# EAGLE design Tau-TOP (EAGLE 9.5.2)
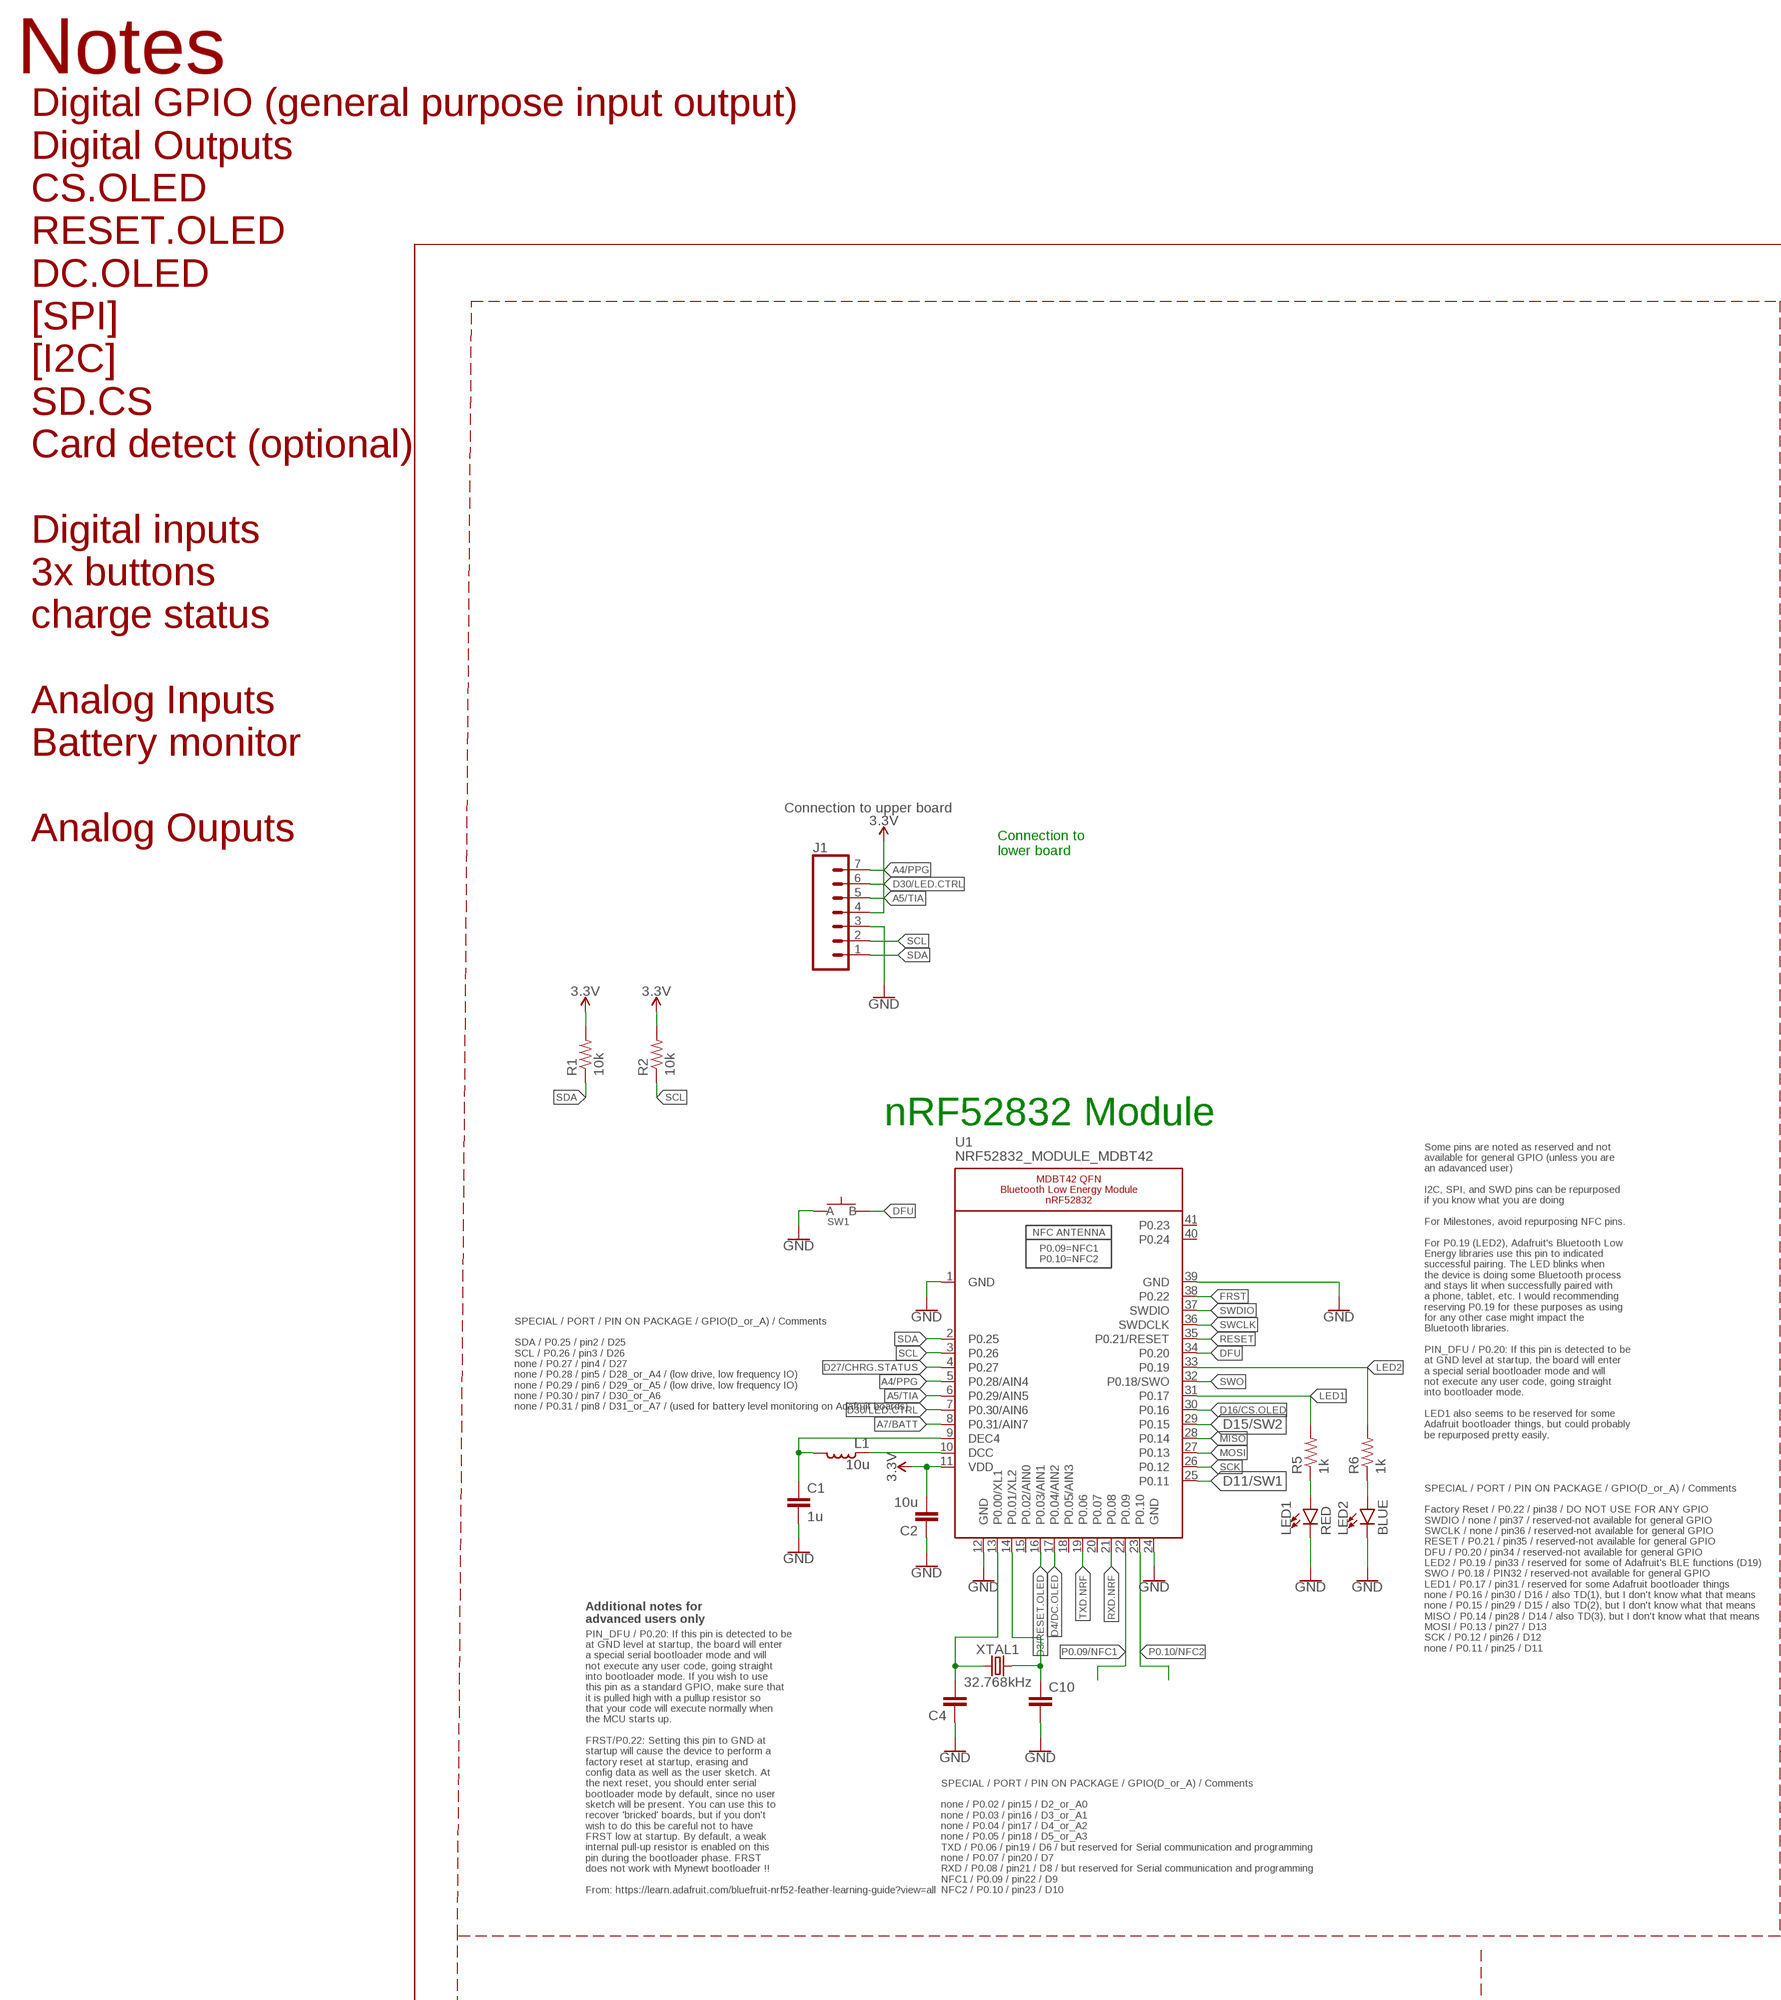
[diagram p0: schematic, sheet 1, part 1 of 3]
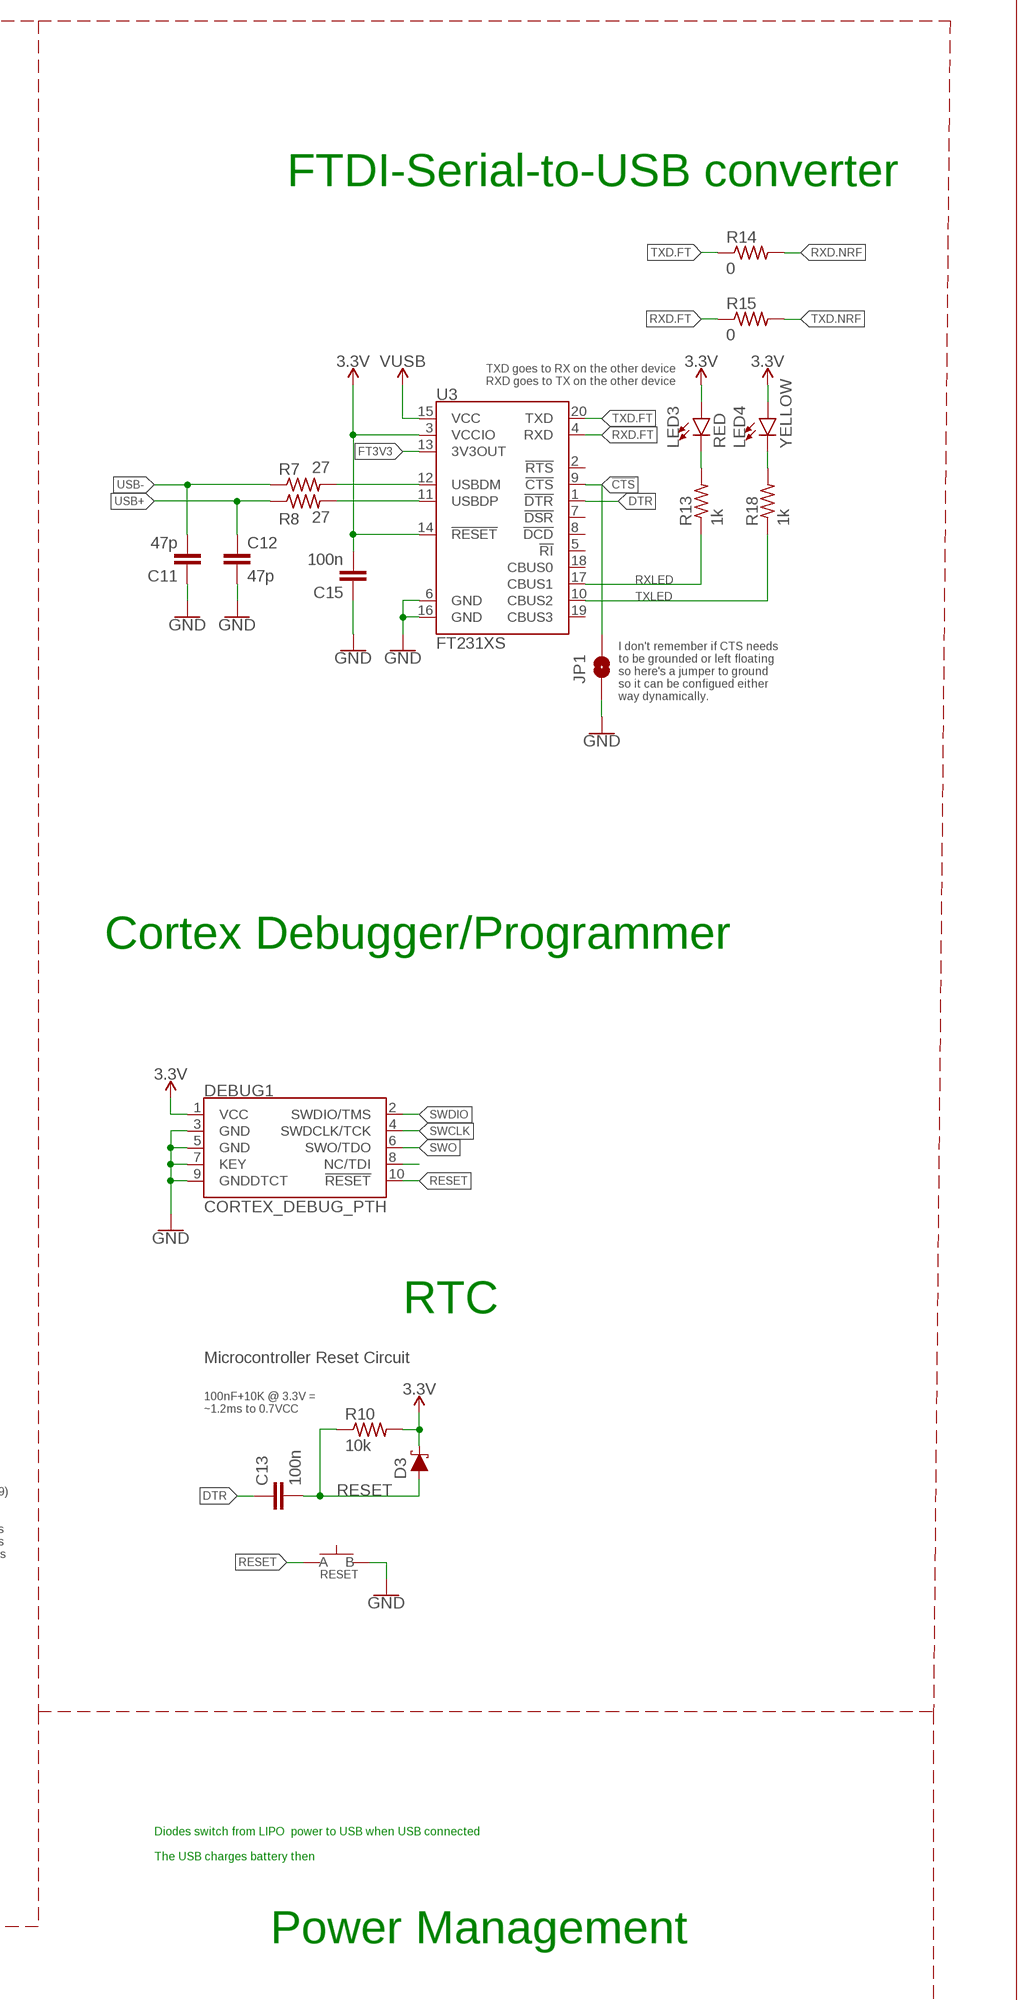
[diagram p1: schematic, sheet 1, part 2 of 3]
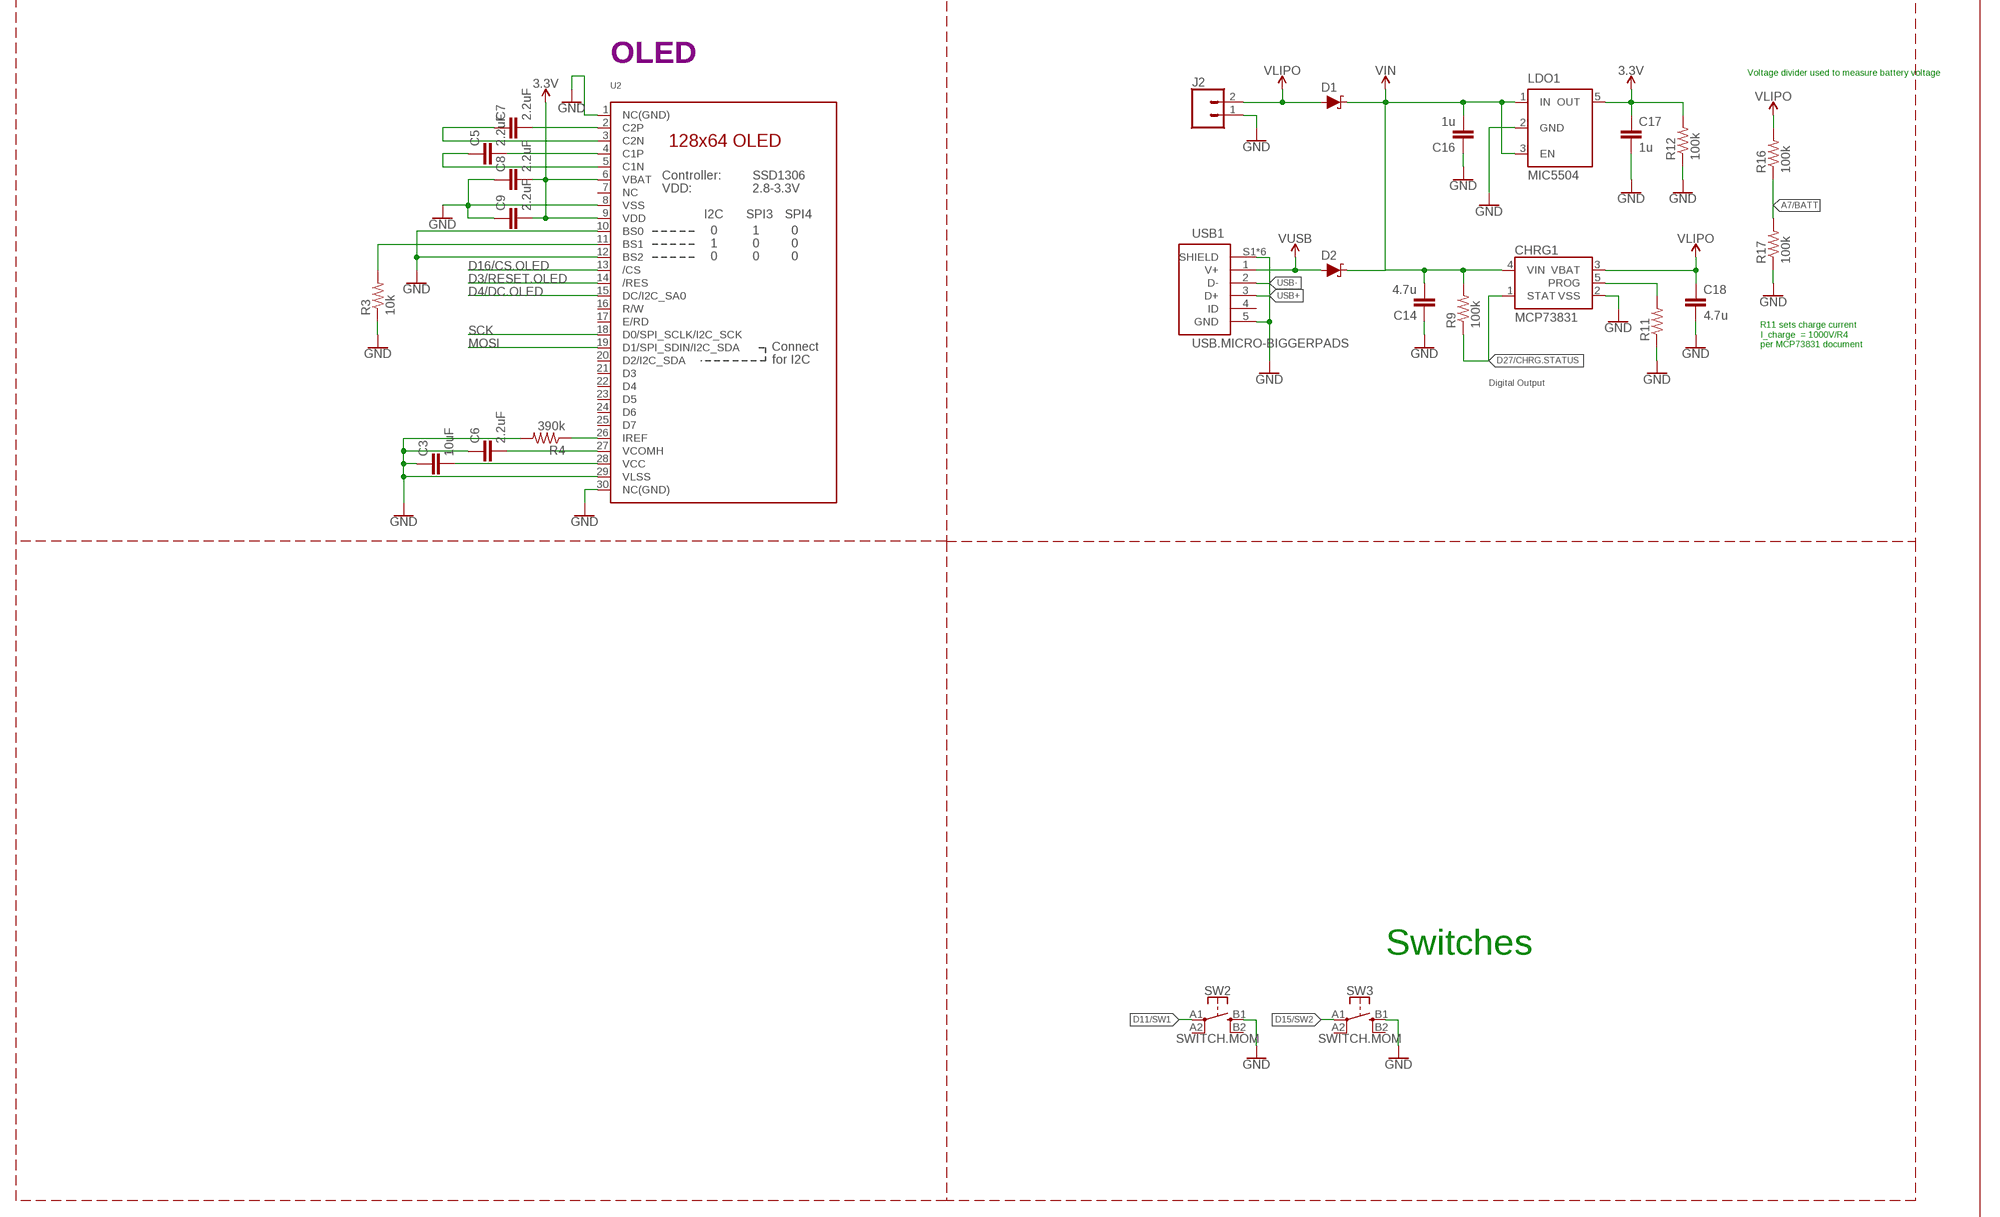
[diagram p2: schematic, sheet 1, part 3 of 3]

## Parts
C1  1u  CAPACITOR0603  [C0603]
C2  10u  CAPACITOR0805  [C0805]
C3  10uF  CAPACITOR0603  [C0603]
C4  CAPACITOR0603  [C0603]
C5  2.2uF  CAPACITOR0402  [C0402]
C6  2.2uF  CAPACITOR0402  [C0402]
C7  2.2uF  CAPACITOR0402  [C0402]
C8  2.2uF  CAPACITOR0402  [C0402]
C9  2.2uF  CAPACITOR0402  [C0402]
C10  CAPACITOR0603  [C0603]
C11  47p  CAPACITOR0603  [C0603]
C12  47p  CAPACITOR0603  [C0603]
C13  100n  CAPACITOR0603  [C0603]
C14  4.7u  CAPACITOR0603  [C0603]
C15  100n  CAPACITOR0603  [C0603]
C16  1u  CAPACITOR0603  [C0603]
C17  1u  CAPACITOR0603  [C0603]
C18  4.7u  CAPACITOR0603  [C0603]
CHRG1  MCP73831  [SOT23-5]
D1  SCHOTTKY-USC  [USC]
D2  SCHOTTKY-USC  [USC]
D3  SCHOTTKY-USC  [USC]
DEBUG1  CORTEX_DEBUG_PTH  [2X5-PTH-1.27MM]
J1  CONN_07-1.27MM  [1X07_1.27MM]
J2  CONN_02  [1X02]
JP1  JUMPER-SMT_2_NO_SILK  [SMT-JUMPER_2_NO_SILK]
L1  10u  INDUCTOR0603  [L0603]
LDO1  MIC5504  [SOT23-5]
LED1  RED  LED0603  [LED-0603]
LED2  BLUE  LED0603  [LED-0603]
LED3  RED  LED0603  [LED-0603]
LED4  YELLOW  LED0603  [LED-0603]
R1  10k  RESISTOR0603  [R0603]
R2  10k  RESISTOR0603  [R0603]
R3  10k  RESISTOR0603  [R0603]
R4  390k  RESISTOR0603  [R0603]
R5  1k  RESISTOR0603  [R0603]
R6  1k  RESISTOR0603  [R0603]
R7  27  RESISTOR0603  [R0603]
R8  27  RESISTOR0603  [R0603]
R9  100k  RESISTOR0603  [R0603]
R10  10k  RESISTOR0603  [R0603]
R11  RESISTOR0603  [R0603]
R12  100k  RESISTOR0603  [R0603]
R13  1k  RESISTOR0603  [R0603]
R14  0  RESISTOR0603  [R0603]
R15  0  RESISTOR0603  [R0603]
R16  100k  RESISTOR0603  [R0603]
R17  100k  RESISTOR0603  [R0603]
R18  1k  RESISTOR0603  [R0603]
RESET  SPST-PTS830GG140-COPY.1-3  [BUTTON-GULLWING]
SW1  SPST-PTS830GG140-COPY.1-3  [BUTTON-GULLWING]
SW2  SWITCH.MOM  [TACTILE_SWITCH_SMD_6.2MM_TALL]
SW3  SWITCH.MOM  [TACTILE_SWITCH_SMD_6.2MM_TALL]
U1  NRF52832_MODULE_MDBT42  [BLE_MODULE_RAYTAC_MDBT42]
U2  DISP_OLED_UG-2864HSWEG01-NO-WRAPAROUND  [UG-2864HSWEG01_0.96IN_NO-WRAPAROUND]
U3  FT231XS  [SSOP20_L]
USB1  USB.MICRO-BIGGERPADS  [USB-MICRO-01.BIGGERPADS]
XTAL1  32.768kHz  CRYSTALECS-.327-12.5-12-C-TR  [2-SMD.NOLEAD.2.0MMTO1.2MM]

## Nets
3.3V: C2.2 C8.2 C9.2 C15.2 C17.1 D3.-(C) DEBUG1.1(VCC) J1.4 LDO1.5(OUT) LED3.A LED4.A R1.2 R2.2 R10.2 R12.2 U1.11(VDD) U2.6(VBAT) U2.9(VDD) U3.3(VCCIO) U3.14(!RESET)
!CTS: JP1.2 U3.9(!CTS)
A4/PPG: J1.7 U1.5(P0.28/AIN4)
A5/TIA: J1.5 U1.6(P0.29/AIN5)
A7/BATT: R16.1 R17.2 U1.8(P0.31/AIN7)
D3/RESET.OLED: U1.16(P0.03/AIN1) U2.14(/RES)
D4/DC.OLED: U1.17(P0.04/AIN2) U2.15(DC/I2C_SA0)
D11/SW1: SW2.A1 U1.25(P0.11)
D15/SW2: SW3.A1 U1.29(P0.15)
D16/CS.OLED: U1.30(P0.16) U2.13(/CS)
D27/CHRG.STATUS: CHRG1.1(STAT) R9.1 U1.4(P0.27)
D30/LED.CTRL: J1.6 U1.7(P0.30/AIN6)
DFU: SW1.3(B) U1.34(P0.20)
DTR: C13.1 U3.1(!DTR)
FRST: U1.38(P0.22)
FT3V3: U3.13(3V3OUT)
GND: C1.2 C2.1 C3.1 C4.1 C6.1 C8.1 C9.1 C10.2 C11.1 C12.2 C14.1 C15.1 C16.1 C17.2 C18.2 CHRG1.2(VSS) DEBUG1.3(GND) DEBUG1.5(GND) DEBUG1.7(KEY) DEBUG1.9(GNDDTCT) J1.3 J2.1 JP1.1 LDO1.2(GND) LED1.C LED2.C R3.1 R4.2 R11.1 R12.1 R17.1 RESET.3(B) SW1.1(A) SW2.B1 SW3.B1 U1.1(GND) U1.12(GND) U1.24(GND) U1.39(GND) U2.1(NC(GND)) U2.8(VSS) U2.10(BS0) U2.12(BS2) U2.29(VLSS) U2.30(NC(GND)) U3.6(GND) U3.16(GND) USB1.5(GND) USB1.S1(SHIELD) USB1.S2(SHIELD) USB1.S3(SHIELD) USB1.S4(SHIELD) USB1.S5(SHIELD) USB1.S6(SHIELD)
LED1: R5.2 U1.31(P0.17)
LED2: R6.2 U1.33(P0.19)
MISO: U1.28(P0.14)
MOSI: U1.27(P0.13) U2.19(D1/SPI_SDIN/I2C_SDA)
N$1: R3.2 U2.11(BS1)
N$2: R4.1 U2.26(IREF)
N$3: C7.2 U2.2(C2P)
N$4: C7.1 U2.3(C2N)
N$5: C5.2 U2.4(C1P)
N$6: C5.1 U2.5(C1N)
N$7: C3.2 U2.28(VCC)
N$8: C6.2 U2.27(VCOMH)
N$9: CHRG1.5(PROG) R11.2
N$22: R7.2 U3.12(USBDM)
N$23: DEBUG1.8(NC/TDI)
N$24: R8.2 U3.11(USBDP)
N$25: LED3.C R13.2
N$26: LED4.C R18.2
N$31: C4.2 U1.13(P0.00/XL1) XTAL1.P$1
N$32: C10.1 U1.14(P0.01/XL2) XTAL1.P$2
N$33: LED1.A R5.1
N$34: LED2.A R6.1
N$35: L1.1 U1.10(DCC)
N$36: C1.1 L1.2 U1.9(DEC4)
P0.09/NFC1: U1.22(P0.09)
P0.10/NFC2: U1.23(P0.10)
RESET: C13.2 D3.+(A) DEBUG1.10(!RESET) R10.1 RESET.1(A) U1.35(P0.21/RESET)
RXD.FT: R15.1 U3.4(RXD)
RXD.NRF: R14.2 U1.21(P0.08)
RXLED: R13.1 U3.17(CBUS1)
SCK: U1.26(P0.12) U2.18(D0/SPI_SCLK/I2C_SCK)
SCL: J1.2 R2.1 U1.3(P0.26)
SDA: J1.1 R1.1 U1.2(P0.25)
SWCLK: DEBUG1.4(SWDCLK/TCK) U1.36(SWDCLK)
SWDIO: DEBUG1.2(SWDIO/TMS) U1.37(SWDIO)
SWO: DEBUG1.6(SWO/TDO) U1.32(P0.18/SWO)
TXD.FT: R14.1 U3.20(TXD)
TXD.NRF: R15.2 U1.19(P0.06)
TXLED: R18.1 U3.10(CBUS2)
USB+: C12.1 R8.1 USB1.3(D+)
USB-: C11.2 R7.1 USB1.2(D-)
V_USB: D2.+(A) U3.15(VCC) USB1.1(V+) ; supply symbol labelled VUSB
VIN: D1.-(C) D2.-(C)
VIN1: C14.2 C16.2 CHRG1.4(VIN) LDO1.1(IN) LDO1.3(EN) R9.2
VLIPO: C18.1 CHRG1.3(VBAT) D1.+(A) J2.2 R16.2
Unconnected: SW2.A2 SW2.B2 SW3.A2 SW3.B2 U1.15(P0.02/AIN0) U1.18(P0.05/AIN3) U1.20(P0.07) U1.40(P0.24) U1.41(P0.23) U2.7(NC) U2.16(R/W) U2.17(E/RD) U2.20(D2/I2C_SDA) U2.21(D3) U2.22(D4) U2.23(D5) U2.24(D6) U2.25(D7) U3.2(!RTS) U3.5(!RI) U3.7(!DSR) U3.8(!DCD) U3.18(CBUS0) U3.19(CBUS3) USB1.4(ID)

## Notes on the sheet
- Notes
- FTDI-Serial-to-USB converter
- TXD goes to RX on the other device
  RXD goes to TX on the other device
- Connection to upper board
- Digital GPIO (general purpose input output)
  Digital Outputs
  CS.OLED
  RESET.OLED
  DC.OLED
  [SPI]
  [I2C]
  SD.CS
  Card detect (optional)
  
  Digital inputs 
  3x buttons
  charge status
  
  Analog Inputs 
  Battery monitor
  
  Analog Ouputs
- Connection to 
  lower board
- I don't remember if CTS needs
  to be grounded or left floating
  so here's a jumper to ground
  so it can be configued either
  way dynamically.
- Cortex Debugger/Programmer
- nRF52832 Module
- SPECIAL / PORT / PIN ON PACKAGE / GPIO(D_or_A) / Comments
  
  SDA / P0.25 / pin2 / D25
  SCL / P0.26 / pin3 / D26
  none / P0.27 / pin4 / D27
  none / P0.28 / pin5 / D28_or_A4 / (low drive, low frequency IO)
  none / P0.29 / pin6 / D29_or_A5 / (low drive, low frequency IO)
  none / P0.30 / pin7 / D30_or_A6
  none / P0.31 / pin8 / D31_or_A7 / (used for battery level monitoring on Adafruit boards)
- RTC
- Some pins are noted as reserved and not
  available for general GPIO (unless you are
  an adavanced user)
  
  I2C, SPI, and SWD pins can be repurposed
  if you know what you are doing
  
  For Milestones, avoid repurposing NFC pins.
  
  For P0.19 (LED2), Adafruit's Bluetooth Low
  Energy libraries use this pin to indicated
  successful pairing. The LED blinks when
  the device is doing some Bluetooth process
  and stays lit when successfully paired with
  a phone, tablet, etc. I would recommending
  reserving P0.19 for these purposes as using
  for any other case might impact the
  Bluetooth libraries.
  
  PIN_DFU / P0.20: If this pin is detected to be
  at GND level at startup, the board will enter
  a special serial bootloader mode and will
  not execute any user code, going straight
  into bootloader mode.
  
  LED1 also seems to be reserved for some
  Adafruit bootloader things, but could probably
  be repurposed pretty easily.
- Microcontroller Reset Circuit
- 100nF+10K @ 3.3V =
  ~1.2ms to 0.7VCC
- Additional notes for
  advanced users only
- SPECIAL / PORT / PIN ON PACKAGE / GPIO(D_or_A) / Comments
  
  Factory Reset / P0.22 / pin38 / DO NOT USE FOR ANY GPIO
  SWDIO / none / pin37 / reserved-not available for general GPIO
  SWCLK / none / pin36 / reserved-not available for general GPIO
  RESET / P0.21 / pin35 / reserved-not available for general GPIO
  DFU / P0.20 / pin34 / reserved-not available for general GPIO
  LED2 / P0.19 / pin33 / reserved for some of Adafruit's BLE functions (D19)
  SWO / P0.18 / PIN32 / reserved-not available for general GPIO
  LED1 / P0.17 / pin31 / reserved for some Adafruit bootloader things
  none / P0.16 / pin30 / D16 / also TD(1), but I don't know what that means
  none / P0.15 / pin29 / D15 / also TD(2), but I don't know what that means
  MISO / P0.14 / pin28 / D14 / also TD(3), but I don't know what that means
  MOSI / P0.13 / pin27 / D13
  SCK / P0.12 / pin26 / D12
  none / P0.11 / pin25 / D11
- Diodes switch from LIPO  power to USB when USB connected
  
  The USB charges battery then
- PIN_DFU / P0.20: If this pin is detected to be
  at GND level at startup, the board will enter
  a special serial bootloader mode and will
  not execute any user code, going straight
  into bootloader mode. If you wish to use
  this pin as a standard GPIO, make sure that
  it is pulled high with a pullup resistor so
  that your code will execute normally when
  the MCU starts up.
  
  FRST/P0.22: Setting this pin to GND at
  startup will cause the device to perform a
  factory reset at startup, erasing and
  config data as well as the user sketch. At
  the next reset, you should enter serial
  bootloader mode by default, since no user
  sketch will be present. You can use this to
  recover 'bricked' boards, but if you don't
  wish to do this be careful not to have
  FRST low at startup. By default, a weak
  internal pull-up resistor is enabled on this
  pin during the bootloader phase. FRST
  does not work with Mynewt bootloader !!
  
  From: https://learn.adafruit.com/bluefruit-nrf52-feather-learning-guide?view=all
- SPECIAL / PORT / PIN ON PACKAGE / GPIO(D_or_A) / Comments
  
  none / P0.02 / pin15 / D2_or_A0
  none / P0.03 / pin16 / D3_or_A1
  none / P0.04 / pin17 / D4_or_A2
  none / P0.05 / pin18 / D5_or_A3
  TXD / P0.06 / pin19 / D6 / but reserved for Serial communication and programming
  none / P0.07 / pin20 / D7
  RXD / P0.08 / pin21 / D8 / but reserved for Serial communication and programming
  NFC1 / P0.09 / pin22 / D9
  NFC2 / P0.10 / pin23 / D10
- Power Management
- OLED
- Voltage divider used to measure battery voltage
- R11 sets charge current
  I_charge  = 1000V/R4
  per MCP73831 document
- Digital Output
- Switches

## Library data of the parts
C1-C18 = LinnesLab-Passives:CAPACITOR
CHRG1 = LinnesLab-Power:MCP73831: MCP73831T Li-Ion, Li-Pol Controller Miniature single cell, fully integrated Li-Ion, Li-polymer charge management controller Datasheet <http://ww1.microchip.com/downloads/en/DeviceDoc/20001984g.pdf> SparkFun Products: SparkFun ESP32 Thing <https://www.sparkfun.com/products/13907> SparkFun 9DoF Razor IMU M0 <https://www.sparkfun.com/products/14001>; PROD_ID: IC-09995
D1-D3 = LinnesLab-DiscreteSemi:SCHOTTKY: Schottky diode A Schottky diode is a semiconductor diode which has a low forward voltage drop and a very fast switching action. Example: Digi-Key Part Number: RB161MM-20CT-ND
DEBUG1 = LinnesLab-Connectors:CORTEX_DEBUG: Cortex Debug Connector - 10 pin Supports JTAG debug, Serial Wire debug, and Serial Wire Viewer. PTH and SMD connector options available. General Connector Information <http://infocenter.arm.com/help/topic/com.arm.doc.faqs/attached/13634/cortex_debug_connectors.pdf> Products: PTH Connector <http://www.digikey.com/product-detail/en/cnc-tech/3220-10-0100-00/1175-1627-ND/3883661> -via Digi-Key SparkFun PSoc <https://www.sparkfun.com/products/13229> SparkFun T <https://www.sparkfun.com/products/13810>
J1 = LinnesLab-Connectors:CONN_07: Multi connection point. Often used as Generic Header-pin footprint for 0.1 inch spaced/style header connections On any of the 0.1 inch spaced packages, you can populate with these: Break Away Headers - Straight <https://www.sparkfun.com/products/116> (PRT-00116) Break Away Male Headers - Right Angle <https://www.sparkfun.com/products/553> (PRT-00553) Female Headers <https://www.sparkfun.com/products/115> (PRT-00115) Break Away Headers - Machine Pin <https://www.sparkfun.com/products/117> (PRT-00117) Break Away Female Headers - Swiss Machine Pin <https://www.sparkfun.com/products/743> (PRT-00743) For SCREWTERMINALS and SPRING TERMINALS visit here: Screw Terimnals on SparkFun.com <https://www.sparkfun.com/search/results?term=Screw+Terminals> (5mm/3.5mm/2.54mm spacing) This device is also useful as a general connection point to wire up your design to another part of your project. Our various solder wires solder well into these plated through hole pads. Hook-Up Wire - Assortment (Stranded, 22 AWG) <https://www.sparkfun.com/products/11375> (PRT-11375) Hook-Up Wire - Assortment (Solid Core, 22 AWG) <https://www.sparkfun.com/products/11367> (PRT-11367) View the entire wire category on our website here <https://www.sparkfun.com/categories/141> Special notes: Molex polarized connector foot print use with SKU : PRT-08231 with associated crimp pins and housings. 1MM SMD Version SKU: PRT-10208 NOTES ON THE VARIANTS LOCK and LOCK_LONGPADS... This footprint was designed to help hold the alignment of a through-hole component (i.e. 6-pin header) while soldering it into place. You may notice that each hole has been shifted either up or down by 0.005 of an inch from it's more standard position (which is a perfectly straight line). This slight alteration caused the pins (the squares in the middle) to touch the edges of the holes. Because they are alternating, it causes a "brace" to hold the component in place. 0.005 has proven to be the perfect amount of "off-center" position when using our standard breakaway headers. Although looks a little odd when you look at the bare footprint, once you have a header in there, the alteration is very hard to notice. Also,if you push a header all the way into place, it is covered up entirely on the bottom side.
J2 = LinnesLab-Connectors:CONN_02: Multi connection point. Often used as Generic Header-pin footprint for 0.1 inch spaced/style header connections On any of the 0.1 inch spaced packages, you can populate with these: Break Away Headers - Straight <https://www.sparkfun.com/products/116> (PRT-00116) Break Away Male Headers - Right Angle <https://www.sparkfun.com/products/553> (PRT-00553) Female Headers <https://www.sparkfun.com/products/115> (PRT-00115) Break Away Headers - Machine Pin <https://www.sparkfun.com/products/117> (PRT-00117) Break Away Female Headers - Swiss Machine Pin <https://www.sparkfun.com/products/743> (PRT-00743) For SCREWTERMINALS and SPRING TERMINALS visit here: Screw Terimnals on SparkFun.com <https://www.sparkfun.com/search/results?term=Screw+Terminals> (5mm/3.5mm/2.54mm spacing) This device is also useful as a general connection point to wire up your design to another part of your project. Our various solder wires solder well into these plated through hole pads. Hook-Up Wire - Assortment (Stranded, 22 AWG) <https://www.sparkfun.com/products/11375> (PRT-11375) Hook-Up Wire - Assortment (Solid Core, 22 AWG) <https://www.sparkfun.com/products/11367> (PRT-11367) View the entire wire category on our website here <https://www.sparkfun.com/categories/141> Special notes: Molex polarized connector foot print use with: PRT-08233 with associated crimp pins and housings. 2.54_SCREWTERM for use with PRT-10571. 3.5mm Screw Terminal footprints for PRT-08084 5mm Screw Terminal footprints for use with PRT-08432
JP1 = LinnesLab-Switches:JUMPER-SMT_2_NO: Normally open jumper This jumper has two pads in close proximity to each other. Apply solder to close the connection. Round pads are easier to solder for beginners, but are a lot larger. SparkFun Product that uses the round pads: SparkFun EL Sequencer <https://www.sparkfun.com/products/12781>
L1 = LinnesLab-Passives:INDUCTOR
LDO1 = LinnesLab-Power:MIC5504: MIC5504 Voltage Regulator Output Voltages: 1.0V to 3.3V Input Voltages: 2.5V to 5.5V Link to Datasheet http://ww1.microchip.com/downloads/en/DeviceDoc/MIC550X.pdf
LED1-LED4 = LinnesLab-LED:LED: LED (Generic) Standard schematic elements and footprints for 5mm, 3mm, 1206, and 0603 sized LEDs. Generic LEDs with no color specified. LTST-C190KGKT: arrow indicates cathode
R1-R18 = LinnesLab-Passives:RESISTOR
RESET SW1 = LinnesLab-Switches:SPST-PTS830GG140-COPY
SW2 SW3 = LinnesLab-Switches:SWITCH.MOM: PTS645SM43SMTR92 LFS
U1 = LinnesLab-Microcontrollers:NRF52832_MODULE_MDBT42: MDBT42 - BLE Module (nRF52832 QFN) VDD: 1.7-3.6V
U2 = LinnesLab-Displays:DISP_OLED_UG-2864HSWEG01: UG-2864HSWEG01 OLED display Both 1.3" and 0.96" models share the same FPC tab footprint, only the screen dimensions vary.
U3 = LinnesLab-DigitalIC:FT231X: FTDI FT231X Full Speed USB to Full-handshake UART This USB2.0 Full Speed IC offers a compact bridge to full handshake UART interfaces. The device is a UART, capable of operating up to 3MBaud, with low power consumption (8mA). The FT231X includes the complete FT-X series feature set and enables USB to be added into a system design quickly and easily over a UART interface. Datasheet <http://cdn.sparkfun.com/datasheets/Components/General%20IC/DS_FT231X.pdf>; DIGIKEY: 768-1156-5-ND; MFN: FT231XS-U
USB1 = LinnesLab-Connectors:USB.MICRO: DigiKey PN: 609-4613-1-ND
XTAL1 = LinnesLab-Clocks:CRYSTAL

## Board
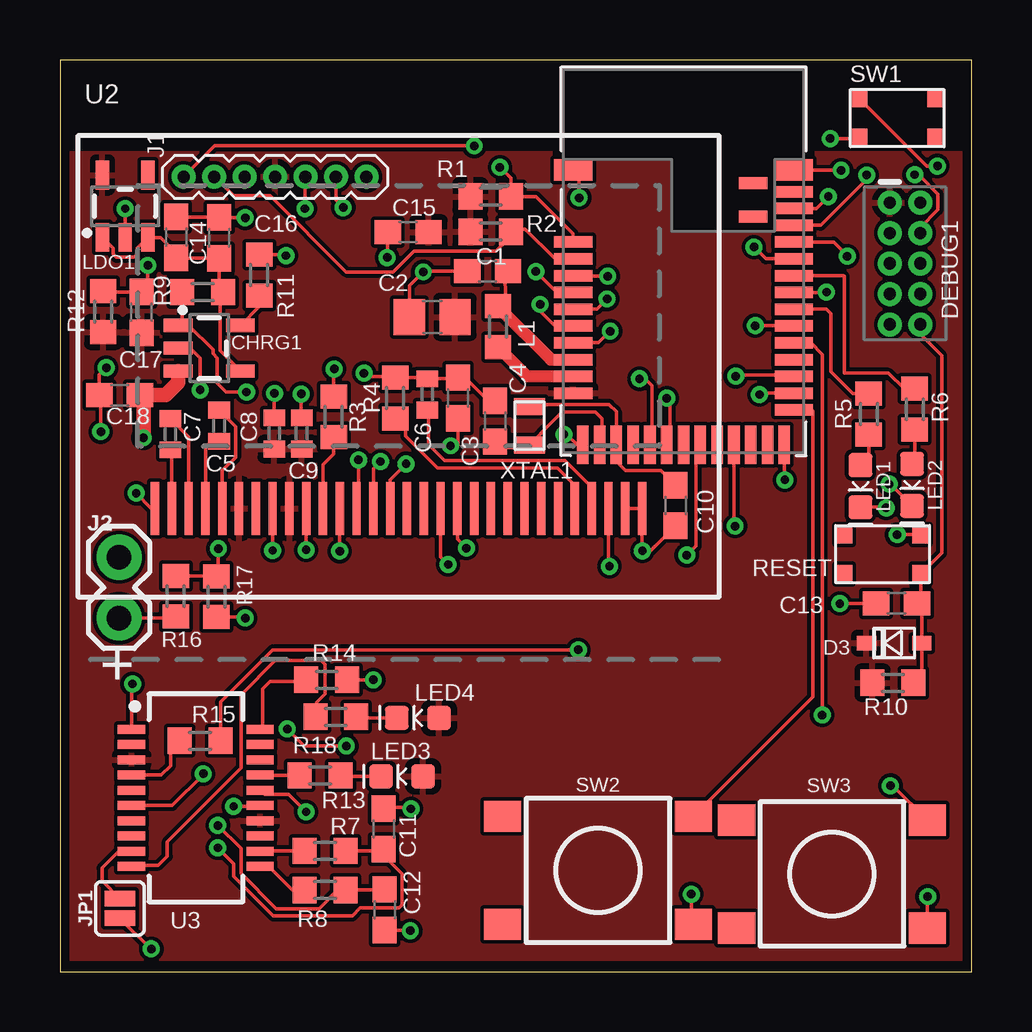
[diagram p3: board, top side]
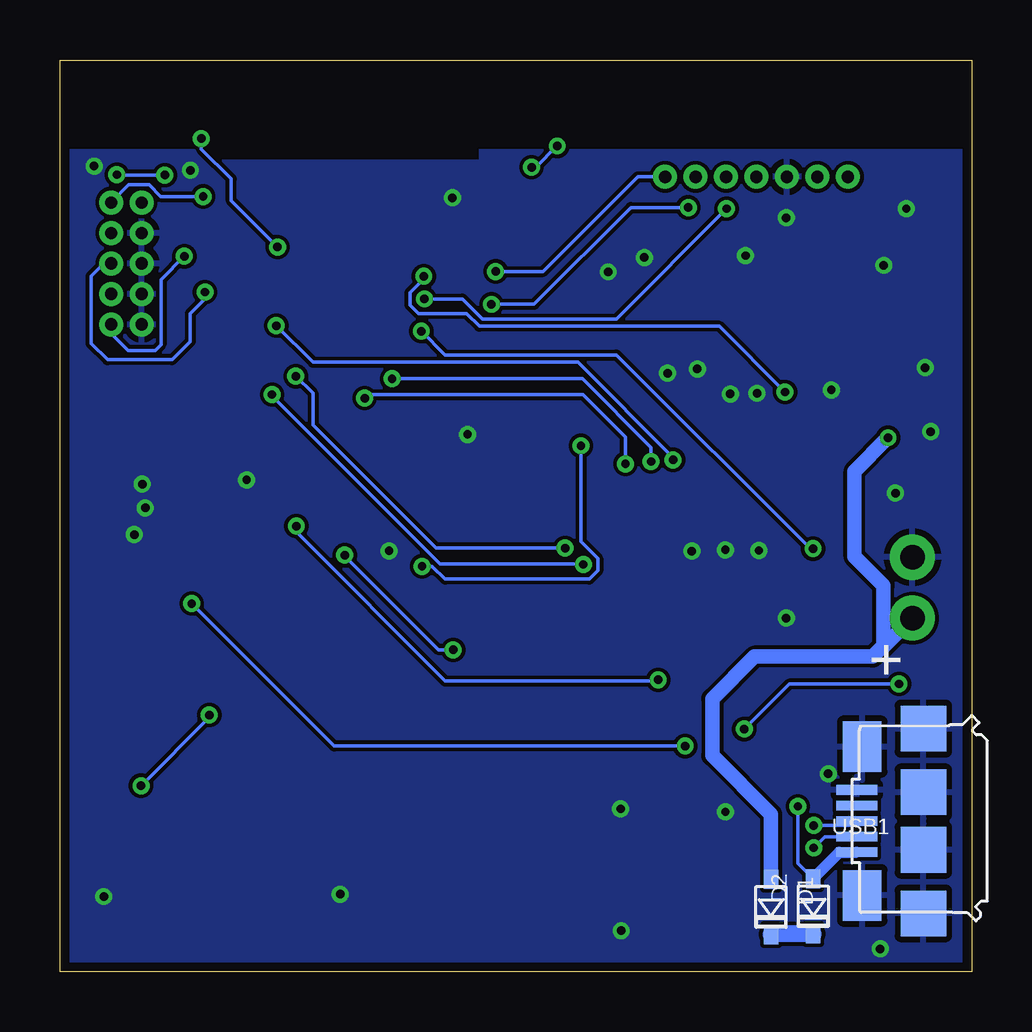
[diagram p4: board, bottom side, seen from below]

Size 38 x 38 mm. Coordinates in mm from the lower left corner, seen from the top.
Outline: 0,0 38,0 38,38 0,38 0,0
Copper layers (1*16): Top 0.0356mm / dielectric 1.5011mm / Bottom 0.0356mm
Design rules "LaenPCBOrder": minimum track width 6mil, minimum drill 13mil, track to track 6mil, track to pad 6mil, pad to pad 6mil, via to via 6mil, smd to smd 6mil, copper to edge 15mil, drill to drill 6mil, minimum pad ring 7mil, minimum via ring 7mil, stop-mask expansion 3mil, vias tented up to drill 0mil, thermal gap 10mil

### Footprints (pad centres in the part's own frame; a part is rotated, then mirrored left to right if it is on the bottom)
C0603 = smd 1.1 x 1: 1 -0.85,0; 2 0.85,0
C0805 = smd 1.3 x 1.5: 1 -0.95,0; 2 0.95,0
C0402 = smd 0.7 x 0.9: 1 -0.65,0; 2 0.65,0
SOT23-5 = smd 0.55 x 1.2: 1 -0.95,-1.3; 2 0,-1.3; 3 0.95,-1.3; 4 0.95,1.3; 5 -0.95,1.3
USC = smd 0.8 x 0.6: + -1.15,0; - 1.15,0
2X5-PTH-1.27MM = drill 0.508 pad 1: 1 -2.54,-0.635; 2 -2.54,0.635; 3 -1.27,-0.635; 4 -1.27,0.635; 5 0,-0.635; 6 0,0.635; 7 1.27,-0.635; 8 1.27,0.635; 9 2.54,-0.635; 10 2.54,0.635
1X07_1.27MM = drill 0.508 pad 1: 1 0,0; 2 1.27,0; 3 2.54,0; 4 3.81,0; 5 5.08,0; 6 6.35,0; 7 7.62,0
1X02 = drill 1.016 pad 1.88: 1 0,0; 2 2.54,0
SMT-JUMPER_2_NO_SILK = smd 0.635 x 1.27: 1 -0.406,0; 2 0.406,0
L0603 = smd 1 x 1.1: 1 -0.85,0; 2 0.85,0
LED-0603 = smd 1 x 1: A -0.877,0; C 0.877,0
R0603 = smd 1 x 1.1: 1 -0.85,0; 2 0.85,0
BUTTON-GULLWING = smd 0.7 x 0.75: 1 -1.6,0.825; 2 1.6,0.825; 3 -1.6,-0.825; 4 1.6,-0.825
TACTILE_SWITCH_SMD_6.2MM_TALL = smd 1.55 x 1.3: A1 -3.975,-2.25; A2 3.975,-2.25; B1 -3.975,2.25; B2 3.975,2.25
BLE_MODULE_RAYTAC_MDBT42 = smd 1.6 x 0.9: 1 -4.6,3.8; 39 4.6,3.8 | smd 1.6 x 0.48: 2 -4.6,0.8; 3 -4.6,0.1; 4 -4.6,-0.6; 5 -4.6,-1.3; 6 -4.6,-2; 7 -4.6,-2.7; 8 -4.6,-3.4; 9 -4.6,-4.1; 10 -4.6,-4.8; 11 -4.6,-5.5; 25 4.6,-6.2; 26 4.6,-5.5; 27 4.6,-4.8; 28 4.6,-4.1; 29 4.6,-3.4; 30 4.6,-2.7; 31 4.6,-2; 32 4.6,-1.3; 33 4.6,-0.6; 34 4.6,0.1; 35 4.6,0.8; 36 4.6,1.5; 37 4.6,2.2; 38 4.6,2.9 | smd 0.48 x 1.6: 12 -4.2,-7.65; 13 -3.5,-7.65; 14 -2.8,-7.65; 15 -2.1,-7.65; 16 -1.4,-7.65; 17 -0.7,-7.65; 18 0,-7.65; 19 0.7,-7.65; 20 1.4,-7.65; 21 2.1,-7.65; 22 2.8,-7.65; 23 3.5,-7.65; 24 4.2,-7.65 | smd 1.2 x 0.5: 40 2.9,3.25; 41 2.9,1.85
UG-2864HSWEG01_0.96IN_NO-WRAPAROUND = smd 0.35 x 2.2: 1 -10.15,-1.2; 2 -9.45,-1.2; 3 -8.75,-1.2; 4 -8.05,-1.2; 5 -7.35,-1.2; 6 -6.65,-1.2; 7 -5.95,-1.2; 8 -5.25,-1.2; 9 -4.55,-1.2; 10 -3.85,-1.2; 11 -3.15,-1.2; 12 -2.45,-1.2; 13 -1.75,-1.2; 14 -1.05,-1.2; 15 -0.35,-1.2; 16 0.35,-1.2; 17 1.05,-1.2; 18 1.75,-1.2; 19 2.45,-1.2; 20 3.15,-1.2; 21 3.85,-1.2; 22 4.55,-1.2; 23 5.25,-1.2; 24 5.95,-1.2; 25 6.65,-1.2; 26 7.35,-1.2; 27 8.05,-1.2; 28 8.75,-1.2; 29 9.45,-1.2; 30 10.15,-1.2
SSOP20_L = smd 0.381 x 1.143: 1 -2.857,-2.68; 2 -2.223,-2.68; 3 -1.587,-2.68; 4 -0.953,-2.68; 5 -0.318,-2.68; 6 0.318,-2.68; 7 0.953,-2.68; 8 1.587,-2.68; 9 2.223,-2.68; 10 2.857,-2.68; 11 2.857,2.68; 12 2.223,2.68; 13 1.587,2.68; 14 0.953,2.68; 15 0.318,2.68; 16 -0.318,2.68; 17 -0.953,2.68; 18 -1.587,2.68; 19 -2.223,2.68; 20 -2.857,2.68
USB-MICRO-01.BIGGERPADS = smd 0.4 x 1.7: 1 -1.3,1.505; 2 -0.65,1.505; 3 0,1.505; 4 0.65,1.505; 5 1.3,1.505 | smd 1.9 x 1.9: S1 -3.85,-1.27; S2 -1.2,-1.27; S3 1.2,-1.27; S4 3.85,-1.27 | smd 2.1 x 1.6: S5 -3.1,1.28; S6 3.1,1.28
2-SMD.NOLEAD.2.0MMTO1.2MM = smd 0.7 x 1.3: P$1 -0.8,0; P$2 0.8,0

### Placement (x,y rotation side)
C1  17.83,29.2 180 top
C2  15.52,27.28 0 top
C3  16.59,23.91 270 top
C4  18.14,22.94 270 top
C5  6.64,22.75 270 top
C6  15.31,24.06 270 top
C7  4.61,22.4 270 top
C8  8.93,22.43 270 top
C9  10.08,22.43 270 top
C10  25.65,19.43 270 top
C11  13.5,5.95 270 top
C12  13.53,2.58 270 top
C13  34.87,15.34 0 top
C14  4.85,30.61 270 top
C15  14.51,30.82 0 top
C16  6.63,30.58 270 top
C17  3.4,27.48 90 top
C18  2.49,24.03 180 top
CHRG1  6.22,25.98 270 top
D1  8.36,2.69 270 bottom
D2  6.6,2.72 270 bottom
D3  34.77,13.69 180 top
DEBUG1  35.23,29.52 270 top
J1  5.15,33.13 0 top
J2  2.46,17.27 270 top
JP1  2.5,2.63 90 top
L1  18.26,26.88 90 top
LDO1  2.72,31.9 0 top
LED1  33.37,20.23 270 top
LED2  35.52,20.28 270 top
LED3  14.26,8.13 180 top
LED4  14.92,10.58 180 top
R1  17.96,32.31 180 top
R2  17.96,30.84 180 top
R3  11.41,23.12 270 top
R4  13.98,23.91 90 top
R5  33.71,23.24 90 top
R6  35.63,23.44 90 top
R7  11.05,5.03 180 top
R8  11.05,3.4 180 top
R9  5.94,28.32 0 top
R10  34.72,12.04 180 top
R11  8.31,29.03 270 top
R12  1.8,27.51 270 top
R13  10.84,8.18 0 top
R14  11.12,12.16 0 top
R15  5.84,9.62 0 top
R16  4.83,15.65 270 top
R17  6.53,15.62 90 top
R18  11.5,10.62 0 top
RESET  34.29,17.4 180 top
SW1  34.9,35.58 0 top
SW2  22.43,4.22 180 top
SW3  32.18,4.06 180 top
U1  25.99,29.61 0 top
U2  14.11,20.5 0 top
U3  5.66,7.24 270 top
USB1  3.28,6.27 90 bottom
XTAL1  19.58,22.75 90 top

### Tracks (layer width: path | path; a pad name or v marks a point on that pad's centre or on a via)
3.3V
  pour Top: 0.28,34.14 37.72,34.14 37.72,0.51 0.28,0.51
!CTS
  Top 0.152: U3.9 2.45,5.02 1.75,4.32 1.75,3.78 JP1.2
A4/PPG  (via drill 0.35)
  Top 0.152: U1.5 21.39,28.37 20.65,28.37 v19.84,29.18
  Bottom 0.152: v19.84,29.18 17.86,29.18 13.91,33.13 J1.7
A5/TIA  (via drill 0.35)
  Top 0.152: v10.21,31.8 10.21,33.1 J1.5 | U1.6 22.38,27.61 v22.81,28.04
  Bottom 0.152: v22.81,28.04 21.23,28.04 20.39,27.21 14.8,27.21 v10.21,31.8
A7/BATT  (via drill 0.35)
  Top 0.152: R16.1 6.5,16.5 R17.2 6.6,16.55 v6.6,17.63 | v22.94,26.7 22.45,26.21 U1.8
  Bottom 0.152: v22.94,26.7 21.95,25.7 14.8,25.7 6.73,17.63 v6.6,17.63
D3/RESET.OLED  (via drill 0.35)
  Top 0.152: U2.14 13.06,20.96 v13.36,21.26 | v24.16,24.71 24.38,24.71 24.67,24.43 24.67,22.04 U1.16
  Bottom 0.152: v13.36,21.26 13.36,21.84 16.23,24.71 v24.16,24.71
D4/DC.OLED  (via drill 0.35)
  Top 0.152: U2.15 13.77,20.5 v14.43,21.16 | v25.3,23.9 25.42,23.78 25.42,22.09 U1.17
  Bottom 0.152: v14.43,21.16 14.43,22.28 16.2,24.05 25.15,24.05 v25.3,23.9
D11/SW1
  Top 0.152: SW2.A1 31.39,11.46 31.39,23.37 31.35,23.41 U1.25
D15/SW2  (via drill 0.35)
  Top 0.152: SW3.A1 34.72,7.75 v34.62,7.75 | U1.29 31.29,26.21 31.77,25.73 v31.77,10.7
  Bottom 0.152: v34.62,7.75 31.77,10.59 v31.77,10.7
D16/CS.OLED  (via drill 0.35)
  Top 0.152: v12.44,21.33 12.44,19.38 U2.13 | v28.98,26.92 30.58,26.92 U1.30
  Bottom 0.152: v12.44,21.33 12.44,21.43 16.41,25.4 27.46,25.4 v28.98,26.92
D27/CHRG.STATUS  (via drill 0.35)
  Top 0.152: R9.1 5.09,27.11 CHRG1.1 5.38,26.93 6.38,25.93 6.38,25.75 6.55,25.57 6.55,24.54 6.93,24.16 v7.77,24.16 | v22.84,28.98 21.42,28.98 U1.4
  Bottom 0.152: v7.77,24.16 10.52,26.9 20.52,26.9 21.05,27.43 23.06,27.43 23.42,27.79 23.42,28.29 22.84,28.87 v22.84,28.98
D30/LED.CTRL  (via drill 0.35)
  Top 0.152: U1.7 20.64,26.91 20.02,27.53 v20.02,27.81 | v11.81,31.85 11.5,32.16 J1.6
  Bottom 0.152: v20.02,27.81 18.24,27.81 14.2,31.85 v11.81,31.85
DFU  (via drill 0.35)
  Top 0.152: v28.93,30.2 29.42,29.71 U1.34 | v32.11,34.72 33.27,34.72 SW1.3
  Bottom 0.152: v28.93,30.2 30.86,32.13 30.86,33.05 32.11,34.29 v32.11,34.72
DTR  (via drill 0.35)
  Top 0.152: U3.1 2.98,11.95 v3.02,11.99 | v32.51,15.34 C13.1 | v9.47,10.11 10.19,9.4 v11.94,9.4
  Bottom 0.152: v3.02,11.99 7.59,11.99 v9.47,10.11 | v32.51,15.34 26.57,9.4 v11.94,9.4
GND  (via drill 0.35)
  Top 0.152: C1.2 15.17,29.2 v15.15,29.17 14.57,28.59 C2.1 | U2.1 3.81,19.3 v3.17,19.94 | C6.1 15.28,24.73 | v12.68,24.94 12.81,24.81 13.92,24.81 R4.2 15.26,24.76 C6.1 | 13.48,6.78 C11.1 13.55,6.85 14.56,6.85 v14.63,6.78 | U3.6 4.69,6.92 5.97,8.21 v5.97,8.24 | C8.1 v8.93,24.1 v8.94,24.11 | C9.1 10.06,23.1 v10.06,24.08 | v11.43,25.12 11.43,24.97 11.41,24.95 R3.1 | U2.29 U2.30 24.27,17.55 v24.28,17.53 24.61,17.53 24.9,17.82 | U1.12 21.55,21.96 21.11,22.39 v21.01,22.39 | R17.1 7.68,14.77 v7.72,14.73 | RESET.3 35.88,18.21 v34.9,18.21 | U1.24 30.19,20.52 v30.22,20.49 | SW3.B1 36.16,3.11 v36.17,3.12 | SW2.B1 26.31,2.06 v26.31,3.23 | U2.8 v8.87,17.55 | U2.10 v10.27,17.58 v10.26,17.58 | U2.12 v11.66,17.53 | C15.1 13.66,29.79 v13.64,29.77 | U3.16 8.52,7.38 9.54,7.38 v10.26,6.66 | C12.2 14.58,1.73 v14.61,1.7 | U1.39 v32.55,33.41 v32.56,33.4 | SW1.1 36.13,33.58 v36.58,33.58 | U1.1 21.64,33.16 v21.64,32.26 | C4.1 18.14,23.92 18.21,24 17.66,24 16.89,24.76 C3.1 16.54,24.71 C6.1 | C10.2 24.9,17.82 | 24.9,17.82 24.75,17.67 | R11.1 9.39,29.88 v9.42,29.84 | R12.1 1.83,28.33 C17.2 3.66,28.59 v3.66,29.44 | LDO1.2 v2.72,31.8 | v1.7,22.5 1.69,22.52 1.69,23.8 1.64,23.9 | v5.84,24.25 5.84,25.57 5.43,25.98 CHRG1.2 | C14.1 6.6,31.46 C16.1 7.71,31.43 v7.72,31.42 | JP1.1 3.78,0.94 v3.81,0.94 | C18.2 1.64,24.88 v1.93,25.17 | 35.42,19.3 LED2.C 34.61,20.32 v34.57,20.32 | LED1.C 34.42,19.35 v34.44,19.33
  pour Bottom: 0.25,34.21 37.64,34.21 37.64,0.3 0.25,0.3
LED1
  Top 0.152: R5.2 33.06,24.09 32.13,25.02 32.13,27.43 31.95,27.61 U1.31
LED2
  Top 0.152: R6.2 35.2,24.29 34.54,24.95 32.69,24.95 32.69,28.98 32.66,29.01 U1.33
MOSI  (via drill 0.35)
  Top 0.152: U2.19 16.57,18.03 v16.94,17.65 | v28.17,24.82 28.22,24.87 30.54,24.87 U1.27
  Bottom 0.152: v16.94,17.65 22.33,17.65 27.46,22.78 27.46,24.11 v28.17,24.82
N$1
  Top 0.152: R3.2 11.41,21.58 10.96,21.13 U2.11
N$2
  Top 0.152: R4.1 14.1,23.06 14.41,22.75 14.41,22.32 15.75,20.98 20.74,20.98 21.46,20.25 U2.26
N$3
  Top 0.152: C7.2 4.67,21.69 U2.2
N$4
  Top 0.152: C7.1 5.37,22.29 U2.3
N$5
  Top 0.152: C5.2 6.31,22.1 6.07,21.86 U2.4
N$6
  Top 0.152: C5.1 7.32,22.73 7.32,21.43 6.76,20.88 U2.5
N$7  (via drill 0.35)
  Top 0.152: C3.2 16.59,21.92 v16.28,21.92 | U2.28 22.86,16.94 v22.91,16.89
  Bottom 0.152: v22.91,16.89 22.48,16.89 21.95,16.36 15.93,16.36 15.57,16.72 15.57,17.22 16.28,17.93 v16.28,21.92
N$8
  Top 0.152: C6.2 15.37,23.35 15.37,21.97 16.03,21.31 21.05,21.31 22.16,20.2 U2.27
N$9
  Top 0.152: CHRG1.5 8.31,27.72 R11.2
N$22
  Top 0.152: R7.2 8.36,5.03 U3.12
N$24
  Top 0.152: R8.2 9.68,3.4 8.7,4.38 U3.11
N$25
  Top 0.152: LED3.C 11.74,8.13 R13.2
N$26
  Top 0.152: LED4.C 12.39,10.58 R18.2
N$31
  Top 0.152: U1.13 22.59,21.86 22.59,23.06 22.33,23.32 20.93,23.32 20.06,22.45 20.06,22.44 XTAL1.P$1 19.47,21.85 18.38,21.85 C4.2
N$32
  Top 0.152: XTAL1.P$2 19.66,23.64 22.89,23.64 23.19,23.34 U1.14 23.19,21.26 23.57,20.88 25.05,20.88 C10.1
N$33
  Top 0.152: LED1.A 33.71,21.45 R5.1
N$34
  Top 0.152: R6.1 35.63,21.27 LED2.A
N$35
  Top 0.508: L1.1 19.48,24.81 U1.10
N$36
  Top 0.152: L1.2 18.58,28.08 18.55,29.07 C1.1
  Top 0.508: L1.2 18.26,27.7 20.46,25.51 U1.9
RESET  (via drill 0.35)
  Top 0.152: 35.89,15.51 35.9,15.52 35.92,15.5 D3.+ 35.92,12.39 35.79,12.26 R10.1 | 35.89,15.51 C13.2 | U1.35 32.25,30.41 32.89,29.77 32.89,29.74 v32.81,29.82 | DEBUG1.10 35.87,26.95 35.61,26.7 35.74,26.7 36.75,25.68 36.75,17.44 RESET.1 35.89,15.51
  Bottom 0.152: v32.81,29.82 33.78,28.85 33.78,26.14 34.04,25.88 35.15,25.88 35.87,26.59 DEBUG1.10
RXD.FT
  Top 0.152: U3.4 4.23,8.19 4.61,8.57 4.61,9.62 R15.1
RXD.NRF  (via drill 0.35)
  Top 0.152: U1.21 28.09,18.62 v28.14,18.57 | R14.2 v13.06,12.16
  Bottom 0.152: v28.14,18.57 28.14,18.32 21.94,12.11 13.11,12.11 v13.06,12.16
RXLED
  Top 0.152: R13.1 8.36,8.18 U3.17
SCK  (via drill 0.35)
  Top 0.152: v16.18,16.97 15.87,17.28 U2.18 | U1.26 29.21,24.11 v29.16,24.05
  Bottom 0.152: v16.18,16.97 16.18,16.99 22.15,16.99 29.21,24.05 v29.16,24.05
SCL
  Top 0.152: U1.3 20.63,29.71 19.39,30.96 18.93,30.96 R2.1 18.82,30.65 18.19,30.02 14.75,30.02 13.89,29.16 11.94,29.16 8.76,32.34 7.24,32.34 6.45,33.13 J1.2
SDA  (via drill 0.35)
  Top 0.152: U1.2 21.39,30.75 19.84,32.31 R1.1 18.81,33.07 v18.35,33.53 v18.34,33.53 | J1.1 6.44,34.42 v17.27,34.42
  Bottom 0.152: v17.27,34.42 18.16,33.53 v18.34,33.53
SWCLK  (via drill 0.35)
  Top 0.152: U1.36 31.72,31.11 33.63,33.02 v33.63,33.2 | DEBUG1.4 35.87,31.02 36.6,31.75 36.6,32.41 35.8,33.22 v35.63,33.22
  Bottom 0.152: v33.63,33.2 35.61,33.2 v35.63,33.22
SWDIO  (via drill 0.35)
  Top 0.152: v32.03,32.31 31.53,31.81 U1.37
  Bottom 0.152: v32.03,32.31 33.8,32.31 34.29,32.79 35.13,32.79 DEBUG1.2
SWO  (via drill 0.35)
  Top 0.152: v31.96,28.32 31.94,28.31 U1.32
  Bottom 0.152: v31.96,28.32 31.96,28.04 32.56,27.44 32.56,26.26 33.33,25.5 36.02,25.5 36.7,26.19 36.7,28.98 36.17,29.52 DEBUG1.6
TXD.FT
  Top 0.152: R14.1 10.2,12.09 8.76,12.09 8.45,11.77 8.45,10.2 U3.20
TXD.NRF  (via drill 0.35)
  Top 0.152: U1.19 26.51,21.78 26.51,17.74 v26.13,17.36 | v21.61,13.41 8.87,13.41 6.69,11.24 R15.2
  Bottom 0.152: v26.13,17.36 26.13,17.33 22.21,13.41 v21.61,13.41
TXLED
  Top 0.152: U3.10 3.03,4.43 4.1,4.43 4.47,4.8 4.47,5.41 7.54,8.48 7.54,11.53 8.98,12.96 10.89,12.96 11.05,12.8 11.05,11.56 10.7,11.22 10.7,10.67 R18.1
USB+  (via drill 0.35)
  Top 0.152: C12.1 13.51,3.4 R8.1 11.57,3.4 10.79,2.62 9.02,2.62 7.54,4.1 7.54,5.12 v6.58,6.09
  Bottom 0.152: USB1.3 4.96,6.09 v6.58,6.09
USB-  (via drill 0.35)
  Top 0.152: C11.2 13.44,5.05 | 13.44,5.05 13.43,5.03 R7.1 | v6.58,5.16 7.24,4.5 7.24,3.97 8.89,2.32 12.19,2.32 12.52,2.65 14.12,2.65 14.26,2.78 14.26,4.07 13.44,4.89 13.44,5.05
  Bottom 0.152: USB1.2 6.11,5.62 v6.58,5.16
V_USB  (via drill 0.35)
  Top 0.152: U3.15 8.31,6.88 v7.24,6.88
  Bottom 0.152: v7.24,6.88 7.24,4.5 D2.+
  Bottom 0.457: D2.+ 6.6,3.89 5.52,4.97 USB1.1
VIN
  Bottom 0.711: D2.- 8.33,1.57 D1.-
VIN1
  Top 0.152: CHRG1.4 6.68,25.88 6.68,28.21 R9.2 6.63,28.48 C16.2 4.88,29.73 C14.2 4.85,29.95 4.2,30.6 LDO1.3 3.22,30.16 3.22,29.91 3.09,29.77 2.35,29.77 2.21,29.91 2.21,30.16 LDO1.1
VLIPO  (via drill 0.35)
  Top 0.152: R16.2 4.78,14.75 2.48,14.75 J2.2
  Top 0.61: v3.48,22.25 3.48,23.89 C18.1 4.4,24.03 4.92,24.55 CHRG1.3
  Bottom 0.61: J2.2 3.67,13.53 3.67,13.58 | 3.67,13.58 4.12,13.13 9.04,13.13 10.8,11.37 10.8,9 8.36,6.55 D1.+ | 3.67,13.58 3.67,16.09 4.88,17.3 4.88,20.85 v3.48,22.25

### Text on the board
tNames: +
bNames: +